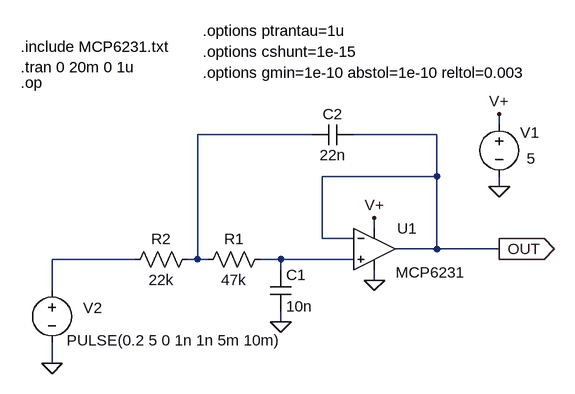
[diagram p0: schematic MCP6231_Test1.asc]
MCP6231_Test1.asc, the LTspice schematic file:
Version 4
SHEET 1 880 680
WIRE 384 -48 384 -64
WIRE 96 -32 -80 -32
WIRE 288 -32 160 -32
WIRE 288 32 288 -32
WIRE 288 32 112 32
WIRE 384 48 384 32
WIRE 192 112 192 96
WIRE 112 128 112 32
WIRE 160 128 112 128
WIRE 288 144 288 32
WIRE 288 144 224 144
WIRE 384 144 288 144
WIRE -176 160 -304 160
WIRE -80 160 -80 -32
WIRE -80 160 -96 160
WIRE -64 160 -80 160
WIRE 48 160 16 160
WIRE 160 160 48 160
WIRE 48 176 48 160
WIRE 192 192 192 176
WIRE -304 208 -304 160
WIRE 48 256 48 240
WIRE -304 320 -304 288
FLAG 384 144 OUT
IOPIN 384 144 Out
FLAG 48 256 0
FLAG -304 320 0
FLAG 192 96 V+
FLAG 384 48 0
FLAG 384 -64 V+
FLAG 192 192 0
SYMBOL cap 32 176 R0
SYMATTR InstName C1
SYMATTR Value 10n
SYMBOL cap 160 -48 R90
WINDOW 0 0 32 VBottom 0
WINDOW 3 32 32 VTop 0
SYMATTR InstName C2
SYMATTR Value 22n
SYMBOL res 32 144 R90
WINDOW 0 0 56 VBottom 0
WINDOW 3 32 56 VTop 0
SYMATTR InstName R1
SYMATTR Value 47k
SYMBOL res -80 144 R90
WINDOW 0 0 56 VBottom 0
WINDOW 3 32 56 VTop 0
SYMATTR InstName R2
SYMATTR Value 22k
SYMBOL voltage 384 -64 R0
WINDOW 0 32 29 Left 0
WINDOW 3 42 69 Left 0
WINDOW 123 0 0 Left 0
WINDOW 39 0 0 Left 0
SYMATTR InstName V1
SYMATTR Value 5
SYMBOL voltage -304 192 R0
WINDOW 123 24 122 Left 0
WINDOW 39 0 0 Left 0
WINDOW 0 48 43 Left 0
WINDOW 3 23 93 Left 0
SYMATTR InstName V2
SYMATTR Value PULSE(0.2 5 0 1n 1n 5m 10m)
SYMBOL Opamps\\opamp2 192 80 R0
WINDOW 0 35 32 Left 0
WINDOW 3 33 100 Left 0
SYMATTR InstName U1
SYMATTR Value MCP6231
TEXT -352 -136 Left 0 !.tran 0 20m 0 1u
TEXT -352 -168 Left 0 !.include MCP6231.txt
TEXT -352 -112 Left 0 !.op
TEXT -72 -192 Left 0 !.options ptrantau=1u
TEXT -72 -160 Left 0 !.options cshunt=1e-15
TEXT -72 -128 Left 0 !.options gmin=1e-10 abstol=1e-10 reltol=0.003

The netlist it stands for:
* MCP6231_Test1.asc
C1 N003 0 10n
C2 OUT N001 22n
R1 N003 N001 47k
R2 N001 N002 22k
V1 V+ 0 5
V2 N002 0 PULSE(0.2 5 0 1n 1n 5m 10m)
XU1 N003 OUT V+ 0 OUT MCP6231  ; pins In+ In- V+ V- OUT
.tran 0 20m 0 1u
.include MCP6231.txt
.op
.options ptrantau=1u
.options cshunt=1e-15
.options gmin=1e-10 abstol=1e-10 reltol=0.003
.backanno
.end